# Altium schematic sheet 8.SATA&TFCARD.SchDoc
size A4
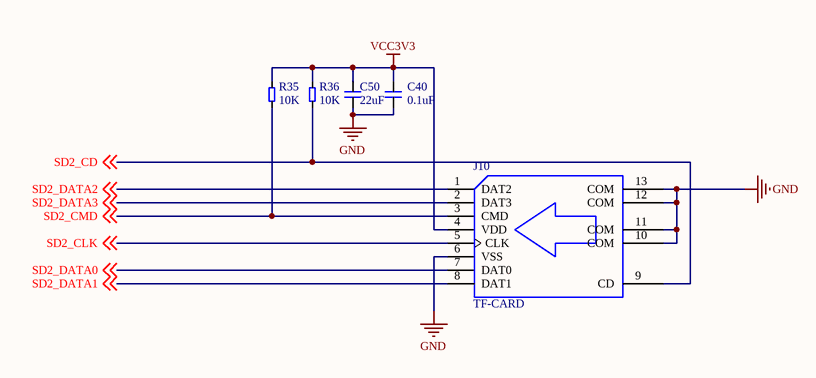
[diagram p0: 8.SATA&TFCARD.SchDoc]

## Parts
C40  0.1uF  [0603C]
C50  22uF  [0603C]
J10  TF-CARD  [TF-CARD]
R35  10K  [0603R]
R36  10K  [0603R]

## Nets
GND: C40.1 C50.1 J10.6(VSS) J10.10(COM) J10.11(COM) J10.12(COM) J10.13(COM)
VCC3V3: C40.2 C50.2 J10.4(VDD) R35.2 R36.2
SD2_CD: J10.9(CD) R36.1 ; off-sheet SD2_CD
SD2_CLK: J10.5(CLK) ; off-sheet SD2_CLK
SD2_CMD: J10.3(CMD) R35.1 ; off-sheet SD2_CMD
SD2_DATA0: J10.7(DAT0) ; off-sheet SD2_DATA0
SD2_DATA1: J10.8(DAT1) ; off-sheet SD2_DATA1
SD2_DATA2: J10.1(DAT2) ; off-sheet SD2_DATA2
SD2_DATA3: J10.2(DAT3) ; off-sheet SD2_DATA3

## Library data of the parts
C40 C50 = 电容
R35 R36 = 电阻